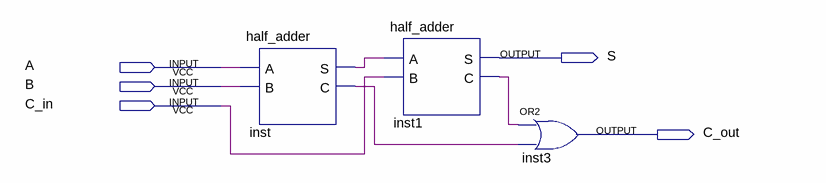
[diagram p0: schematic sheet]
// Quartus schematic full_adder_1_bit.bdf as structural Verilog: 3 symbols, 5 pins
module full_adder_1_bit (
  input  A,
  input  B,
  input  C_in,
  output S,
  output C_out
);

  wire inst1_c, inst_c, inst_s;

  half_adder inst (.A(A), .B(B), .S(inst_s), .C(inst_c));
  half_adder inst1 (.A(inst_s), .B(C_in), .S(S), .C(inst1_c));
  or inst3 (C_out, inst1_c, inst_c);
endmodule
